# Altium project MEMSBreakout.PrjPcb
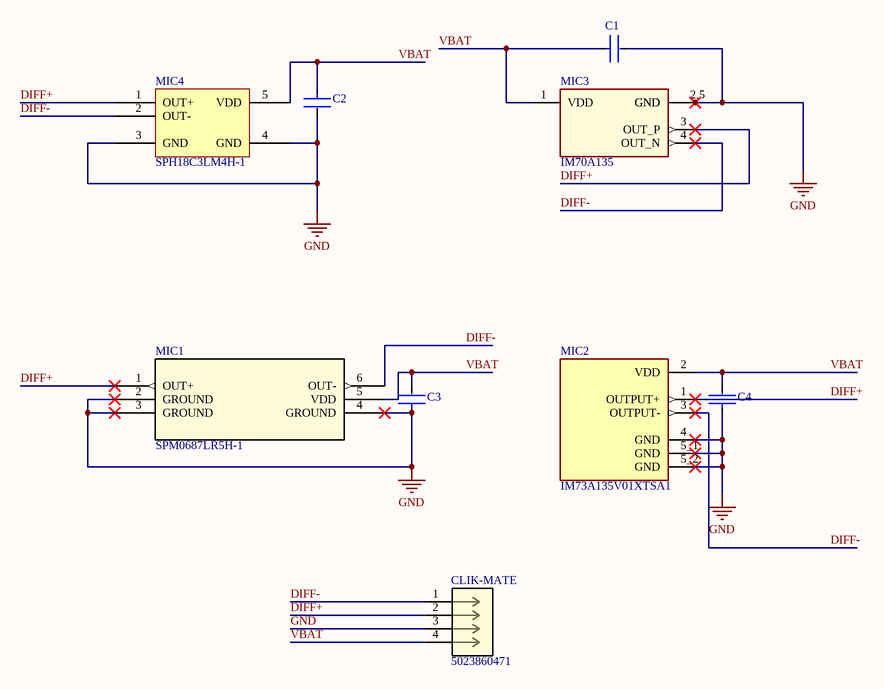
[diagram p0: MEMSBreakout.SchDoc]
1 sheet, 9 parts. Net scope: global (net labels, ports and power ports of the same name join across sheets).
Board file: PCB2.PcbDoc

## Sheet MEMSBreakout.SchDoc
size A; SheetNumber: 1; SheetTotal: 1

### Parts
C1  C1206C104J3GACTU  [FP-C1206C-EB-MFG]  (value not drawn)
C2  C1206C104J3GACTU  [FP-C1206C-EB-MFG]  (value not drawn)
C3  C1206C104J3GACTU  [FP-C1206C-EB-MFG]  (value not drawn)
C4  C1206C104J3GACTU  [FP-C1206C-EB-MFG]  (value not drawn)
CLIK-MATE  5023860471  [CONN_502386-04xx_MOL]
MIC1  SPM0687LR5H-1  [SPM0687LR5H-1_KNO]
MIC2  IM73A135V01XTSA1  [MIC_IM73A135V01XTSA1]
MIC3  IM70A135  [IFX-PG-TLGA-5-2-V]
MIC4  SPH18C3LM4H-1  [SPH18C3LM4H-1]

### Nets
GND: C1.2 C2.2 C3.1 C4.1 CLIK-MATE.3 MIC1.2(GROUND) MIC1.3(GROUND) MIC1.4(GROUND) MIC2.4(GND) MIC2.5_1(GND) MIC2.5_2(GND) MIC3.2(GND) MIC3.5(GND) MIC4.3(GND) MIC4.4(GND)
DIFF+: CLIK-MATE.2 MIC1.1(OUT+) MIC2.1(OUTPUT+) MIC3.3(OUT_P) MIC4.1(OUT+)
DIFF-: CLIK-MATE.1 MIC1.6(OUT-) MIC2.3(OUTPUT-) MIC3.4(OUT_N) MIC4.2(OUT-)
VBAT: C1.1 C2.1 C3.2 C4.2 CLIK-MATE.4 MIC1.5(VDD) MIC2.2(VDD) MIC3.1(VDD) MIC4.5(VDD)

### Notes on the sheet
- (in symbol IM70A135) 2,5

### Library data of the parts
C1-C4 = CMP-1037-04189-2: CAP CER 0.1UF 25V 5% NP0 1206; Manufacturer: KEMET; Value: 0.10 μF; Tolerance: 0.05; Temperature Coefficient: 15%; Automotive Grade: Grade 0; Material: Ceramic; Description: C1206 0.10 μF C0G 5.00% 25 V; Temperature Characteristic: C0G; Automotive: Yes; Ipc Land Pattern Name: CAPC320160X78; ComponentLink2Description: Datasheet; Height: 0.88mm; Digikey Description: CAP CER 0.1UF 25V 5% NP0 1206; Capacitance: 0.10 μF; Category: Cap; Package: C1206C-EB; Device Class L3: Ceramic Capacitors; Octopart: https://octopart.com/c1206c104j3gactu-kemet-9145095; Device Class L1: Passive Components; Device Class L2: Capacitors; Voltage Rating: 25 V; Lead Free: Yes; Mouser Description: Multilayer Ceramic Capacitors MLCC - SMD/SMT 25volts 0.1uF 5% C0G; Temperature: -55°C to +150°C; ComponentLink2URL: https://content.kemet.com/datasheets/KEM_C1007_X8R_ULTRA_150C_SMD.pdf; RoHS: TRUE; Temperature Range High: +150°C; Temperature Range Low: -55°C; Manufacturer Part Number: C1206C104J3GACTU
CLIK-MATE = 5023860471: No Description Available; Mfr_Name: Molex Connector Corporation; RefDes: RefDes; Type: Type
MIC1 = SPM0687LR5H-1: No Description Available; Mfr_Name: Knowles; RefDes: RefDes; Type: Type
MIC2 = IM73A135V01XTSA1: 28 Hz ~ 1 kHz Digital, PDM Microphone MEMS (Silicon) 1.52 V ~ 3 V Noise Cancelling (-38dB) Solder Pads; MF: Infineon Technologies; Check_prices: https://www.snapeda.com/parts/IM73A135V01XTSA1/Infineon+Technologies/view-part/?ref=eda; Value: *; Availability: In Stock; Price: None; Package: None; MP: IM73A135V01XTSA1; SnapEDA_Link: https://www.snapeda.com/parts/IM73A135V01XTSA1/Infineon+Technologies/view-part/?ref=snap; Purchase-URL: https://pricing.snapeda.com/search/part/IM73A135V01XTSA1/?ref=eda
MIC3 = IM70A135: High Performance Analog XENSIV MEMS Microphone; Manufacturer: Infineon Technologies; Manufacturer Order Number: IM70A135; PackageReference: PG-TLGA-5-5